# Altium project Günsel B9 LA Project.PrjPCB
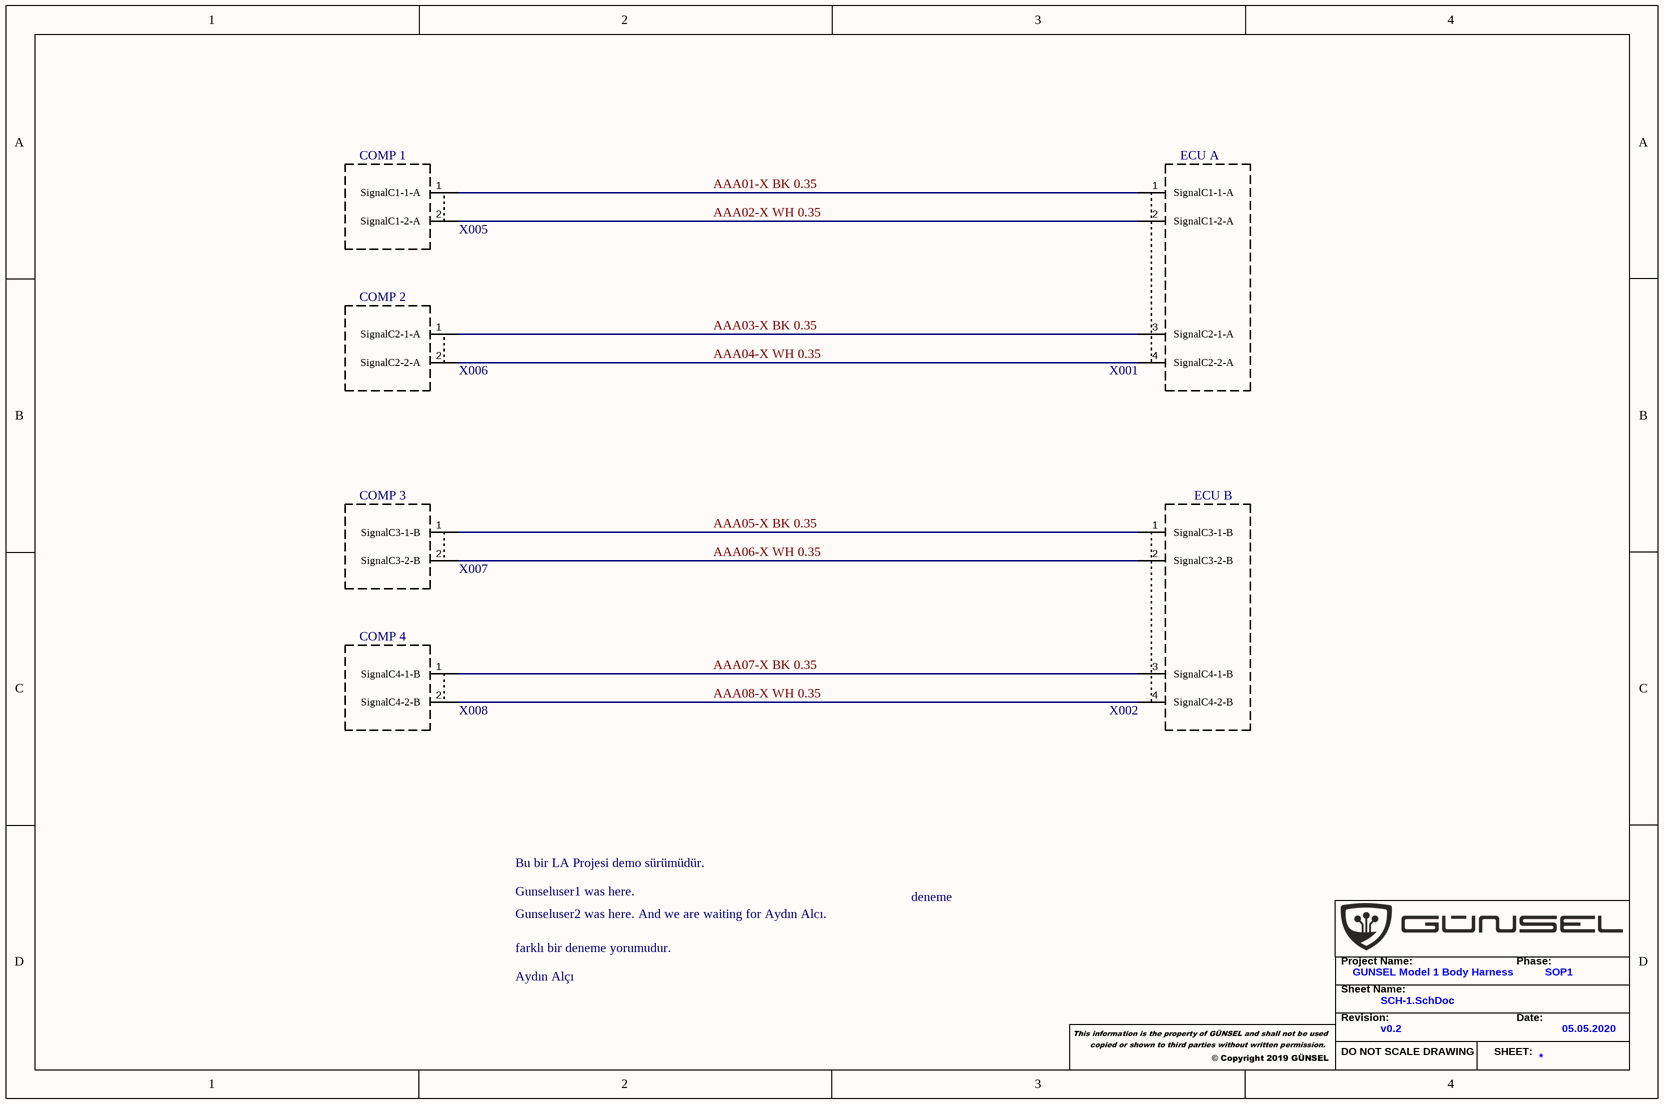
[diagram p0: SCH-1.SchDoc]
5 sheets, 30 parts. Net scope: global (net labels, ports and power ports of the same name join across sheets).
Sheets:
  SCH-1.SchDoc
  SCH-2.SchDoc
  SCH-3.SchDoc
  SCH-4.SchDoc
  SCH-5.SchDoc

## Sheet SCH-1.SchDoc
size A4; Date: 05.05.2020; Organization: Günsel Model 1 Body Harness; Revision: v0.2

### Parts
X1  X001
X2  X005
X3  X006
X4  X002
X5  X007
X6  X008

### Blocks framed on the sheet
ECU A: X1
ECU B: X4

### Nets
AAA01-X BK 0.35: X1.1(SignalC1-1-A) X2.1(SignalC1-1-A)
AAA02-X WH 0.35: X1.2(SignalC1-2-A) X2.2(SignalC1-2-A)
AAA03-X BK 0.35: X1.3(SignalC2-1-A) X3.1(SignalC2-1-A)
AAA04-X WH 0.35: X1.4(SignalC2-2-A) X3.2(SignalC2-2-A)
AAA05-X BK 0.35: X4.1(SignalC3-1-B) X5.1(SignalC3-1-B)
AAA06-X WH 0.35: X4.2(SignalC3-2-B) X5.2(SignalC3-2-B)
AAA07-X BK 0.35: X4.3(SignalC4-1-B) X6.1(SignalC4-1-B)
AAA08-X WH 0.35: X4.4(SignalC4-2-B) X6.2(SignalC4-2-B)

Not connected (* = marked no-connect by the designer): X1 5 6 7 8 9 10 11 12 13 14 15 16 17 18 19 20; X2 3 4 5; X3 3(SHT-CRC-1) 4 5; X4 5 6 7 8 9 10 11 12 13 14 15 16 17 18 19 20; X5 3 4 5; X6 3(SHT-CRC-2) 4(SHT-CRC-3) 5(SHT-CRC-4)

### Notes on the sheet
- (near X2) COMP 1
- (near X3) COMP 2
- (near X5) COMP 3
- (near X6) COMP 4
- Bu bir LA Projesi demo sürümüdür.
- Gunseluser1 was here.
- deneme
- Gunseluser2 was here. And we are waiting for Aydın Alcı.
- farklı bir deneme yorumudur.
- Aydın Alçı
- Project Name:
- GUNSEL Model 1 Body Harness
- Phase:
- SOP1
- Sheet Name:
- Revision:
- DO NOT SCALE DRAWING
- SHEET:
- Date:

### Library data of the parts
X1 = ECU A: Designator_: X001; Pin count: 20; Manufacturer Part number: E-1
X2 = COMP 1: Designator_: X005; Pin count: 5; Manufacturer Part number: C-1
X3 = COMP2: Designator_: X006; Pin count: 5; Manufacturer Part number: C-2
X4 = ECU B: Designator_: X002; Pin count: 20; Manufacturer Part number: E-2
X5 = COMP 3: Designator_: X007; Pin count: 5; Manufacturer Part number: C-3
X6 = COMP 4: Designator_: X008; Pin count: 5; Manufacturer Part number: C-4

## Sheet SCH-2.SchDoc
size A4; Date: 05.05.2020; Organization: Günsel Model 1 Body Harness; Revision: v0.1
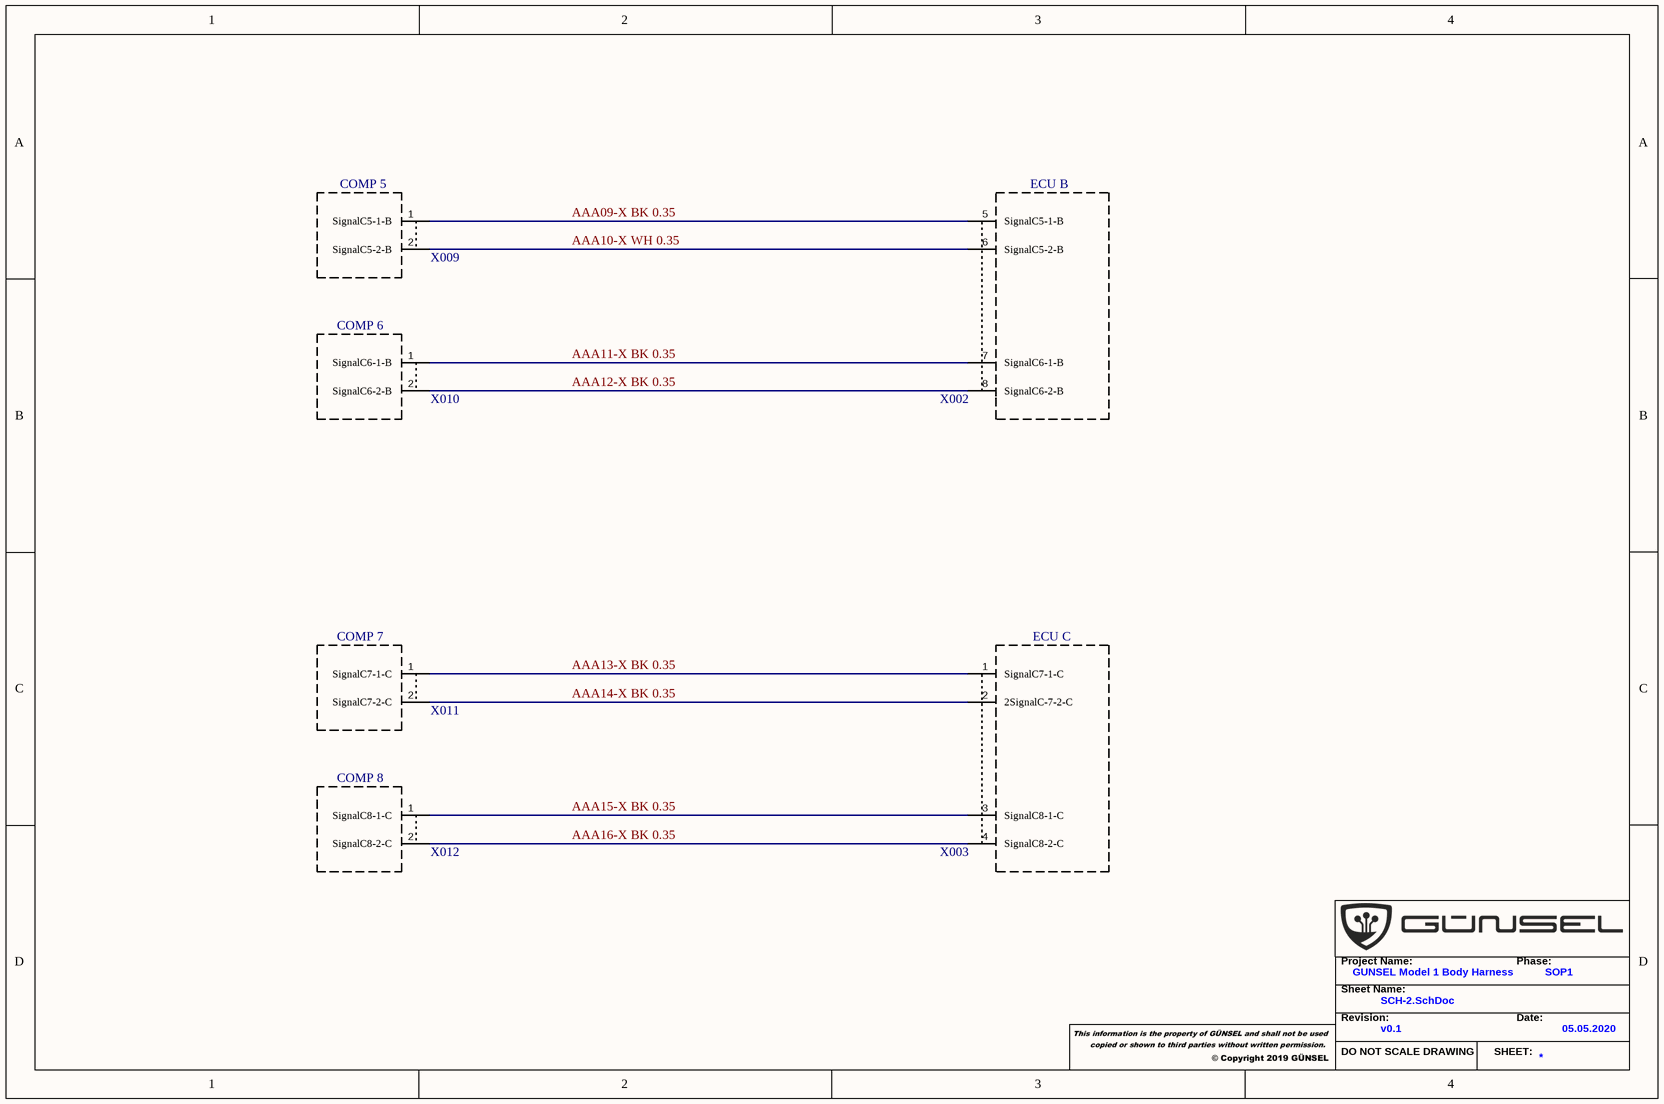
[diagram p1: SCH-2.SchDoc]

### Parts
X7  X002
X8  X009
X9  X010
X10  X003
X11  X011
X12  X012

### Blocks framed on the sheet
COMP 7: X11
ECU C: X10

### Nets
AAA09-X BK 0.35: X7.5(SignalC5-1-B) X8.1(SignalC5-1-B)
AAA10-X WH 0.35: X7.6(SignalC5-2-B) X8.2(SignalC5-2-B)
AAA11-X BK 0.35: X7.7(SignalC6-1-B) X9.1(SignalC6-1-B)
AAA12-X BK 0.35: X7.8(SignalC6-2-B) X9.2(SignalC6-2-B)
AAA13-X BK 0.35: X10.1(SignalC7-1-C) X11.1(SignalC7-1-C)
AAA14-X BK 0.35: X10.2(2SignalC-7-2-C) X11.2(SignalC7-2-C)
AAA15-X BK 0.35: X10.3(SignalC8-1-C) X12.1(SignalC8-1-C)
AAA16-X BK 0.35: X10.4(SignalC8-2-C) X12.2(SignalC8-2-C)

Not connected (* = marked no-connect by the designer): X7 1 2 3 4 9 10 11 12 13 14 15 16 17 18 19 20; X8 3 4 5; X9 3 4 5; X10 5 6 7 8 9 10 11 12 13 14 15 16 17 18 19 20; X11 3 4 5; X12 3 4 5

### Notes on the sheet
- (near X8) COMP 5
- (near X7) ECU B
- (near X9) COMP 6
- (near X12) COMP 8
- Project Name:
- GUNSEL Model 1 Body Harness
- Phase:
- SOP1
- Sheet Name:
- Revision:
- DO NOT SCALE DRAWING
- SHEET:
- Date:

### Library data of the parts
X7 = ECU B: Designator_: X002; Pin count: 20; Manufacturer Part number: E-2
X8 = COMP 5: Designator_: X009; Pin count: 5; Manufacturer Part number: C-5
X9 = COMP 6: Designator_: X010; Pin count: 5; Manufacturer Part number: C-6
X10 = ECU C: Designator_: X003; Pin count: 20; Manufacturer Part number: E-3
X11 = COMP 7: Designator_: X011; Pin count: 5; Manufacturer Part number: C-7
X12 = COMP 8: Designator_: X012; Pin count: 5; Manufacturer Part number: C-8

## Sheet SCH-3.SchDoc
size A4; Date: 05.05.2020; Organization: Günsel Model 1 Body Harness; Revision: v0.1
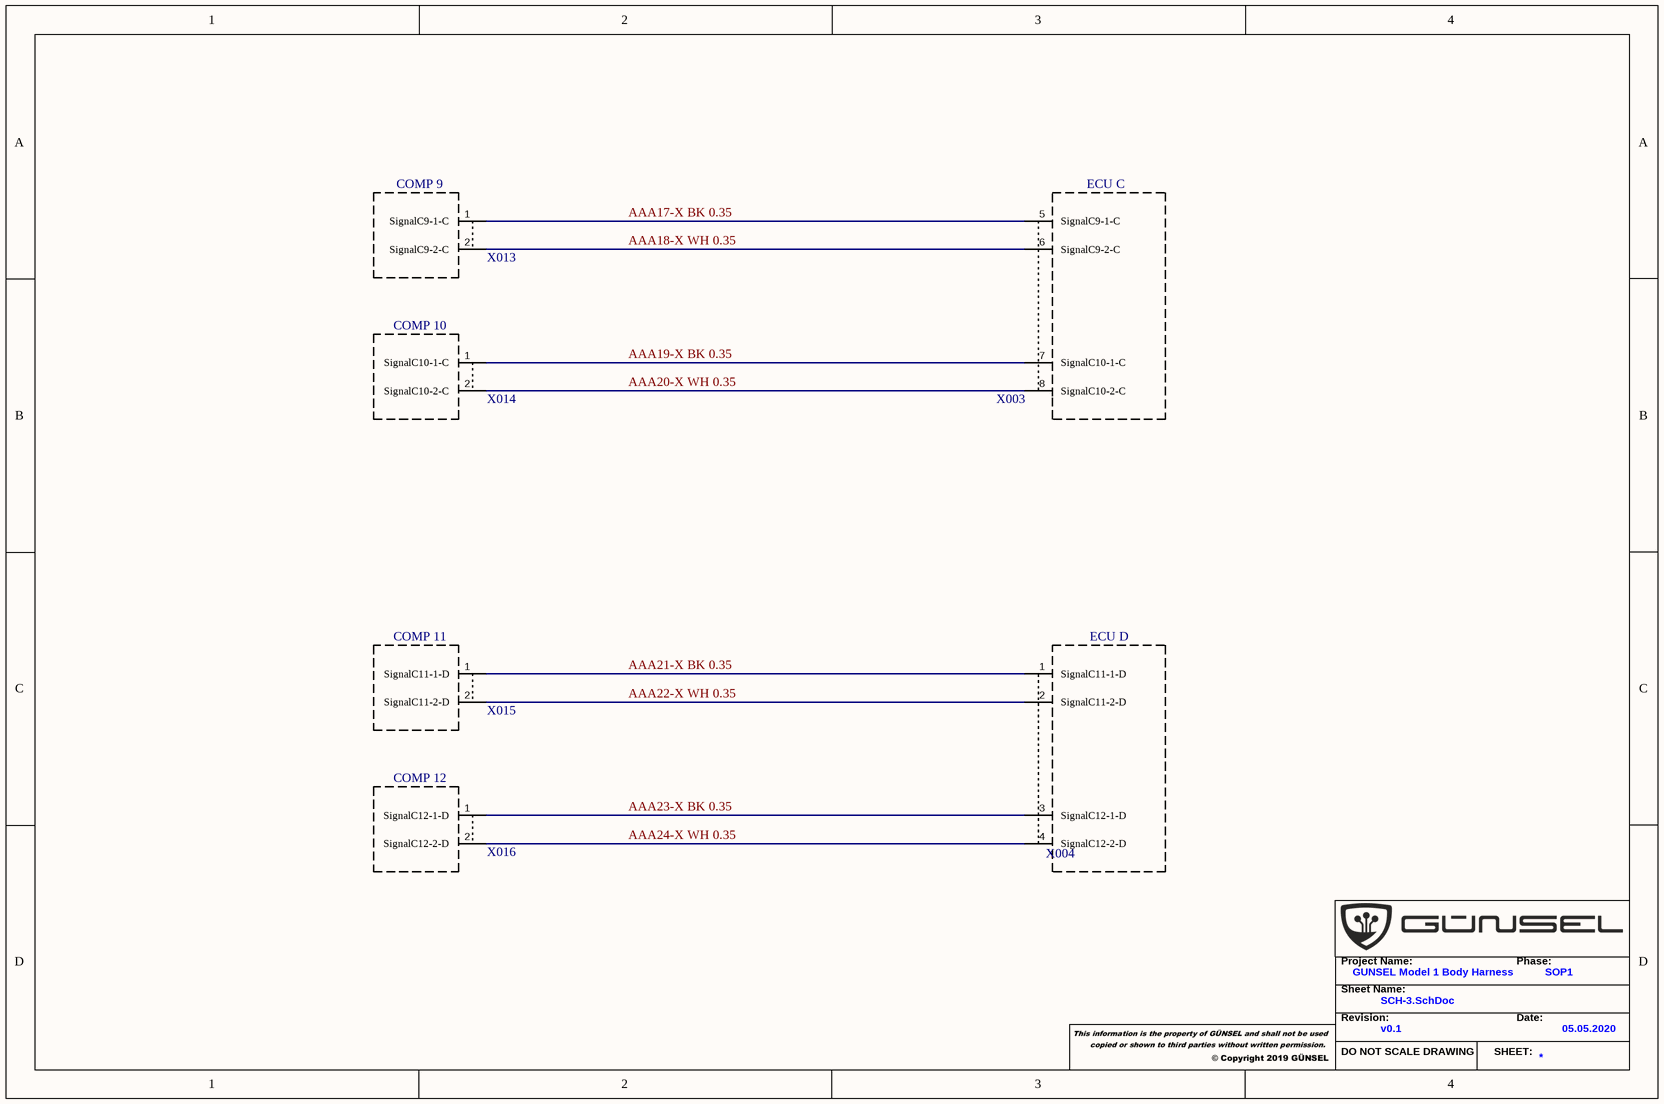
[diagram p2: SCH-3.SchDoc]

### Parts
X13  X003
X14  X013
X15  X014
X16  X004
X17  X015
X18  X016

### Blocks framed on the sheet
ECU D: X16

### Nets
AAA17-X BK 0.35: X13.5(SignalC9-1-C) X14.1(SignalC9-1-C)
AAA18-X WH 0.35: X13.6(SignalC9-2-C) X14.2(SignalC9-2-C)
AAA19-X BK 0.35: X13.7(SignalC10-1-C) X15.1(SignalC10-1-C)
AAA20-X WH 0.35: X13.8(SignalC10-2-C) X15.2(SignalC10-2-C)
AAA21-X BK 0.35: X16.1(SignalC11-1-D) X17.1(SignalC11-1-D)
AAA22-X WH 0.35: X16.2(SignalC11-2-D) X17.2(SignalC11-2-D)
AAA23-X BK 0.35: X16.3(SignalC12-1-D) X18.1(SignalC12-1-D)
AAA24-X WH 0.35: X16.4(SignalC12-2-D) X18.2(SignalC12-2-D)

Not connected (* = marked no-connect by the designer): X13 1 2 3 4 9 10 11 12 13 14 15 16 17 18 19 20; X14 3 4 5; X15 3 4 5; X16 5 6 7 8 9 10 11 12 13 14 15 16 17 18 19 20; X17 3 4 5; X18 3 4 5

### Notes on the sheet
- (near X14) COMP 9
- (near X13) ECU C
- (near X15) COMP 10
- (near X17) COMP 11
- (near X18) COMP 12
- Project Name:
- GUNSEL Model 1 Body Harness
- Phase:
- SOP1
- Sheet Name:
- Revision:
- DO NOT SCALE DRAWING
- SHEET:
- Date:

### Library data of the parts
X13 = ECU C: Designator_: X003; Pin count: 20; Manufacturer Part number: E-3
X14 = COMP 9: Designator_: X013; Pin count: 5; Manufacturer Part number: C-9
X15 = COMP 10: Designator_: X014; Pin count: 5; Manufacturer Part number: C-10
X16 = ECU D: Designator_: X004; Pin count: 20; Manufacturer Part number: E-4
X17 = COMP 11: Designator_: X015; Pin count: 5; Manufacturer Part number: C-11
X18 = COMP 12: Designator_: X016; Pin count: 5; Manufacturer Part number: C-12

## Sheet SCH-4.SchDoc
size A4; Date: 05.05.2020; Organization: Günsel Model 1 Body Harness; Revision: v0.1
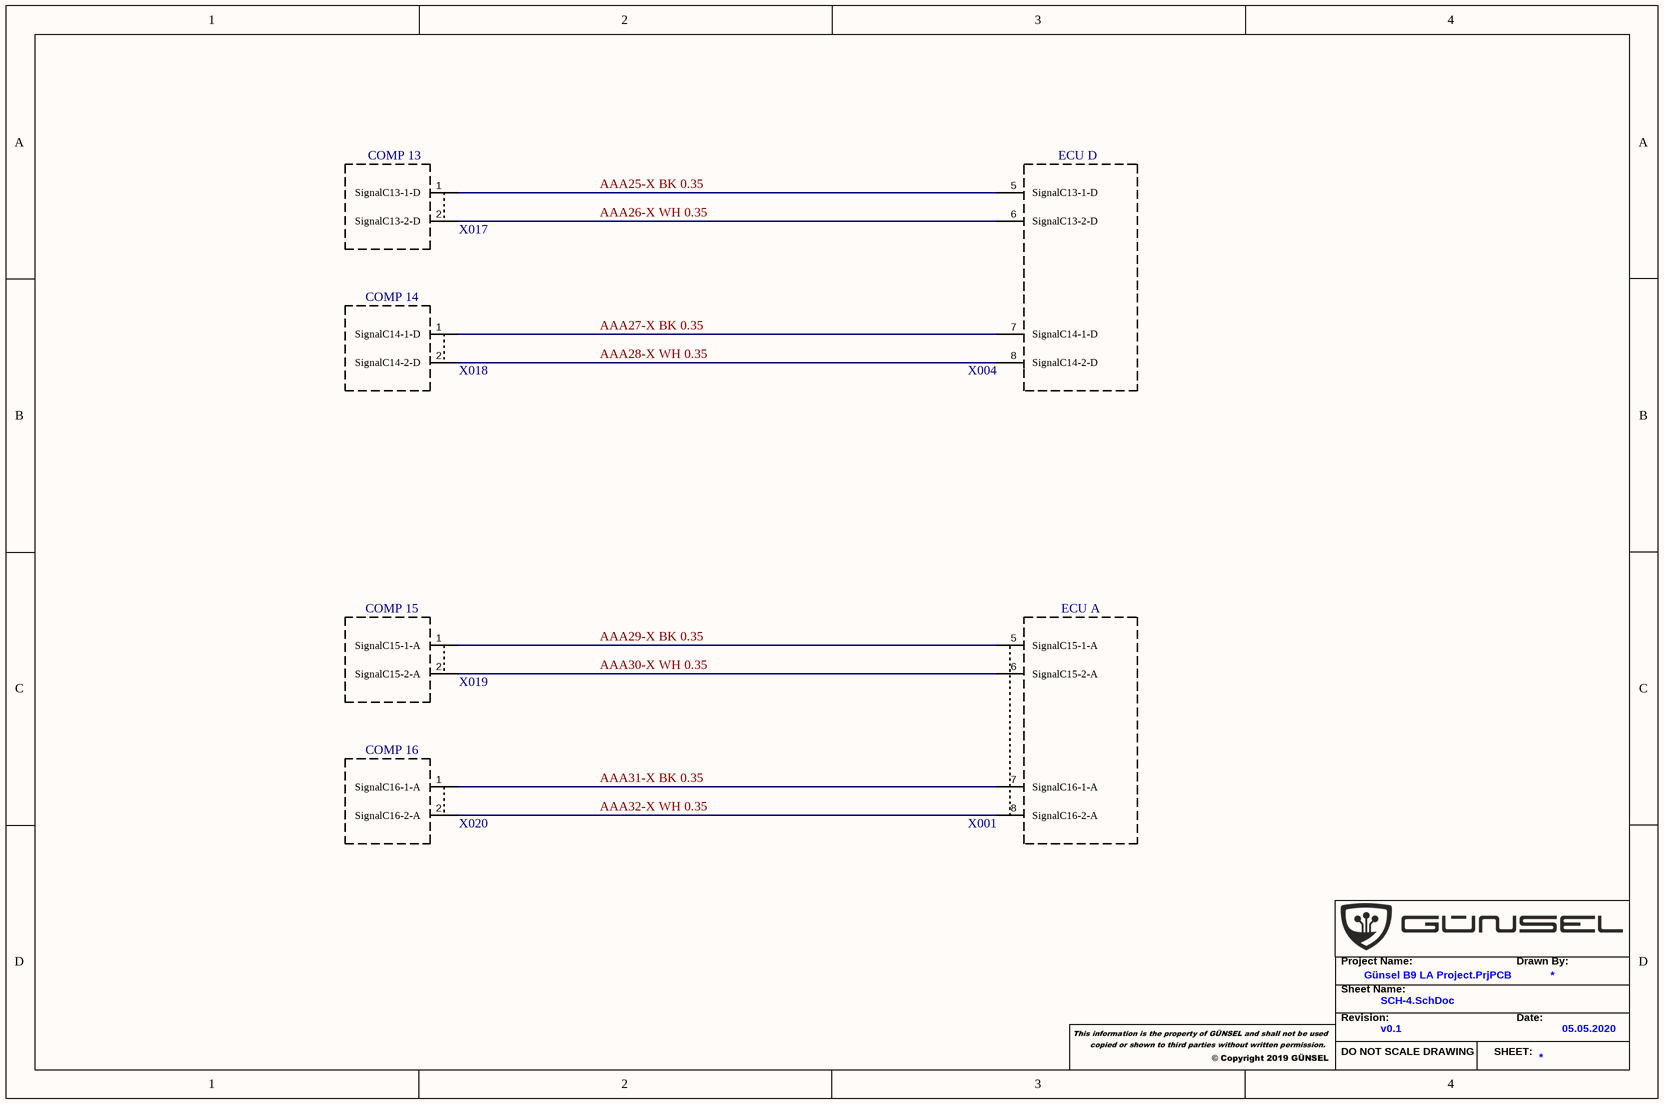
[diagram p3: SCH-4.SchDoc]

### Parts
X19  X004
X20  X017
X21  X018
X22  X001
X23  X019
X24  X020

### Blocks framed on the sheet
ECU A: X22

### Nets
AAA25-X BK 0.35: X19.5(SignalC13-1-D) X20.1(SignalC13-1-D)
AAA26-X WH 0.35: X19.6(SignalC13-2-D) X20.2(SignalC13-2-D)
AAA27-X BK 0.35: X19.7(SignalC14-1-D) X21.1(SignalC14-1-D)
AAA28-X WH 0.35: X19.8(SignalC14-2-D) X21.2(SignalC14-2-D)
AAA29-X BK 0.35: X22.5(SignalC15-1-A) X23.1(SignalC15-1-A)
AAA30-X WH 0.35: X22.6(SignalC15-2-A) X23.2(SignalC15-2-A)
AAA31-X BK 0.35: X22.7(SignalC16-1-A) X24.1(SignalC16-1-A)
AAA32-X WH 0.35: X22.8(SignalC16-2-A) X24.2(SignalC16-2-A)

Not connected (* = marked no-connect by the designer): X19 1 2 3 4 9 10 11 12 13 14 15 16 17 18 19 20; X20 3 4 5; X21 3 4 5; X22 1 2 3 4 9 10 11 12 13 14 15 16 17 18 19 20; X23 3 4 5; X24 3 4 5

### Notes on the sheet
- (near X20) COMP 13
- (near X19) ECU D
- (near X21) COMP 14
- (near X23) COMP 15
- (near X24) COMP 16
- Project Name:
- Drawn By:
- Sheet Name:
- Revision:
- DO NOT SCALE DRAWING
- SHEET:
- Date:

### Library data of the parts
X19 = ECU D: Designator_: X004; Pin count: 20; Manufacturer Part number: E-4
X20 = COMP 13: Designator_: X017; Pin count: 5; Manufacturer Part number: C-13
X21 = COMP 14: Designator_: X018; Pin count: 5; Manufacturer Part number: C-14
X22 = ECU A: Designator_: X001; Pin count: 20; Manufacturer Part number: E-1
X23 = COMP 15: Designator_: X019; Pin count: 5; Manufacturer Part number: C-15
X24 = COMP 16: Designator_: X020; Pin count: 5; Manufacturer Part number: C-16

## Sheet SCH-5.SchDoc
size A4; Date: 05.05.2020; Organization: Günsel Model 1 Body Harness; Revision: v0.1
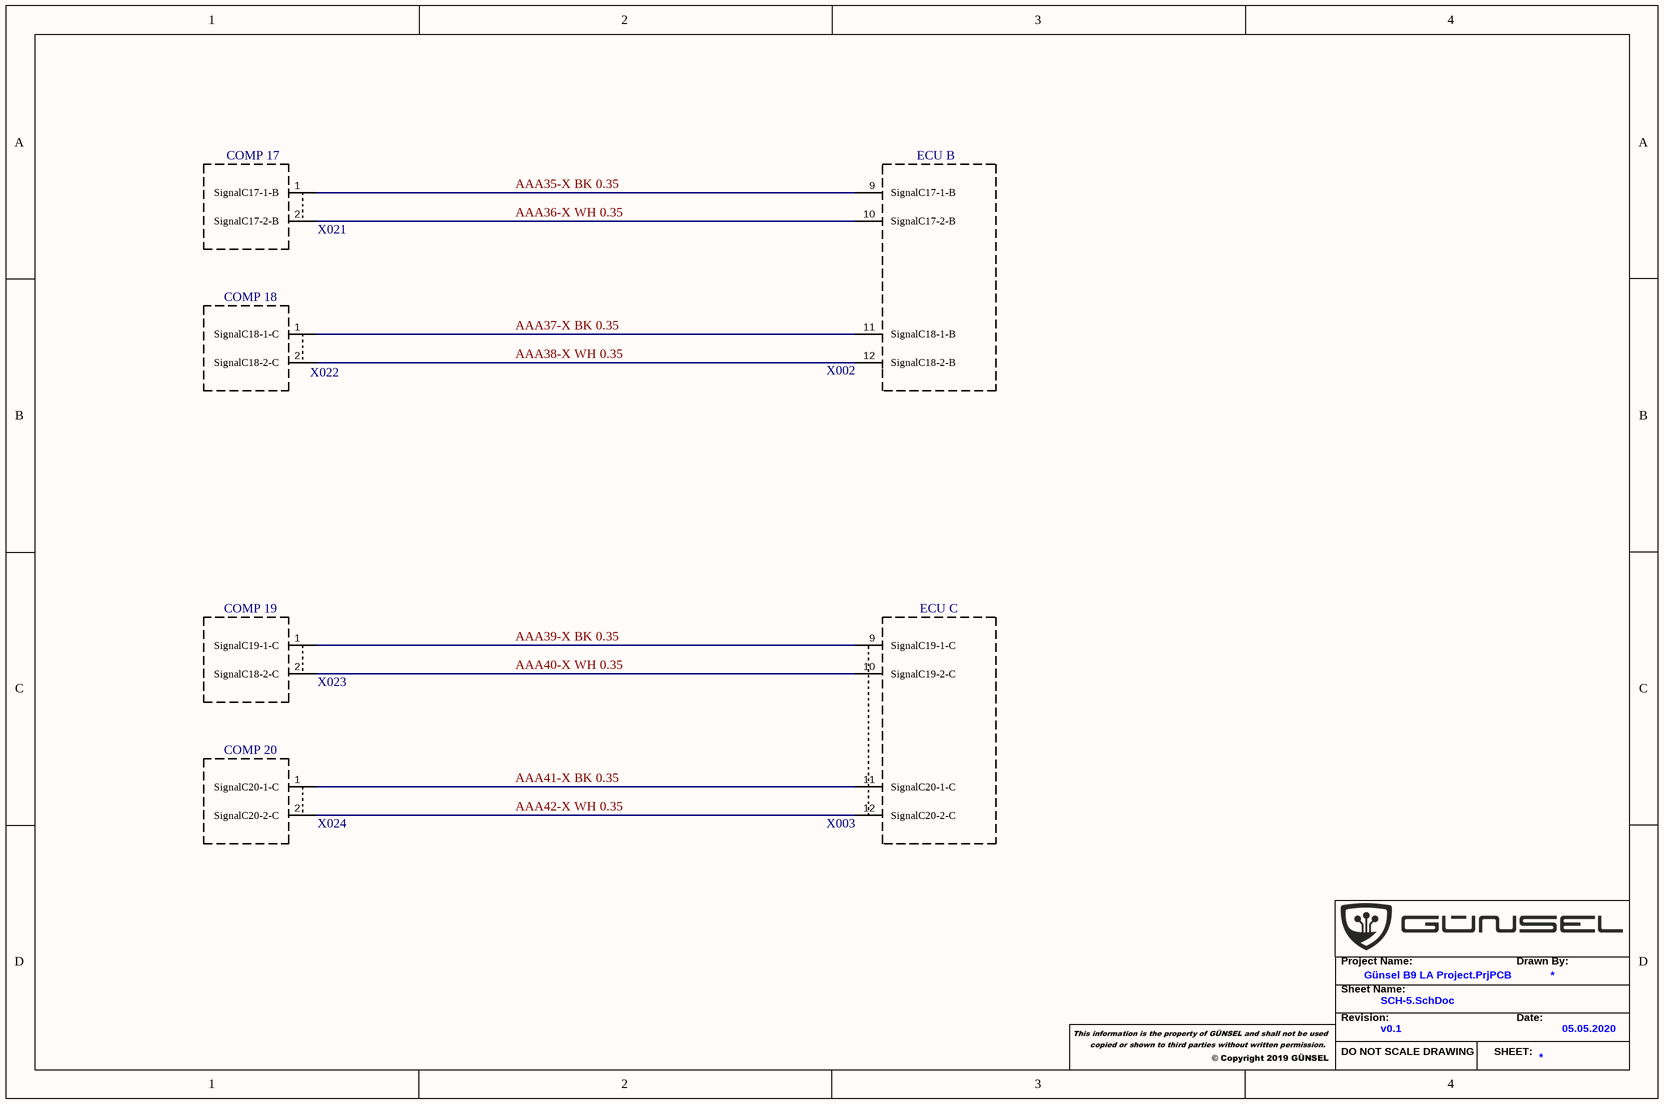
[diagram p4: SCH-5.SchDoc]

### Parts
X25  X002
X26  X021
X27  X022
X28  X003
X29  X023
X30  X024

### Blocks framed on the sheet
COMP 18: X27
COMP 19: X29
ECU C: X28

### Nets
AAA35-X BK 0.35: X25.9(SignalC17-1-B) X26.1(SignalC17-1-B)
AAA36-X WH 0.35: X25.10(SignalC17-2-B) X26.2(SignalC17-2-B)
AAA37-X BK 0.35: X25.11(SignalC18-1-B) X27.1(SignalC18-1-C)
AAA38-X WH 0.35: X25.12(SignalC18-2-B) X27.2(SignalC18-2-C)
AAA39-X BK 0.35: X28.9(SignalC19-1-C) X29.1(SignalC19-1-C)
AAA40-X WH 0.35: X28.10(SignalC19-2-C) X29.2(SignalC18-2-C)
AAA41-X BK 0.35: X28.11(SignalC20-1-C) X30.1(SignalC20-1-C)
AAA42-X WH 0.35: X28.12(SignalC20-2-C) X30.2(SignalC20-2-C)

Not connected (* = marked no-connect by the designer): X25 1 2 3 4 5 6 7 8 13 14 15 16 17 18 19 20; X26 3 4 5; X27 3 4 5; X28 1 2 3 4 5 6 7 8(SignalC10-2-C) 13 14 15 16 17 18 19 20; X29 3 4 5; X30 3 4 5

### Notes on the sheet
- (near X26) COMP 17
- (near X25) ECU B
- (near X30) COMP 20
- Project Name:
- Drawn By:
- Sheet Name:
- Revision:
- DO NOT SCALE DRAWING
- SHEET:
- Date:

### Library data of the parts
X25 = ECU B: Designator_: X002; Pin count: 20; Manufacturer Part number: E-2
X26 = COMP 17: Designator_: X021; Pin count: 5; Manufacturer Part number: C-17
X27 = COMP 18: Designator_: X022; Pin count: 5; Manufacturer Part number: C-18
X28 = ECU C: Designator_: X003; Pin count: 20; Manufacturer Part number: E-3
X29 = COMP 19: Designator_: X023; Pin count: 5; Manufacturer Part number: C-19
X30 = COMP 20: Designator_: X024; Pin count: 5; Manufacturer Part number: C-20